# Altium schematic sheet In-Out.SchDoc
size A3
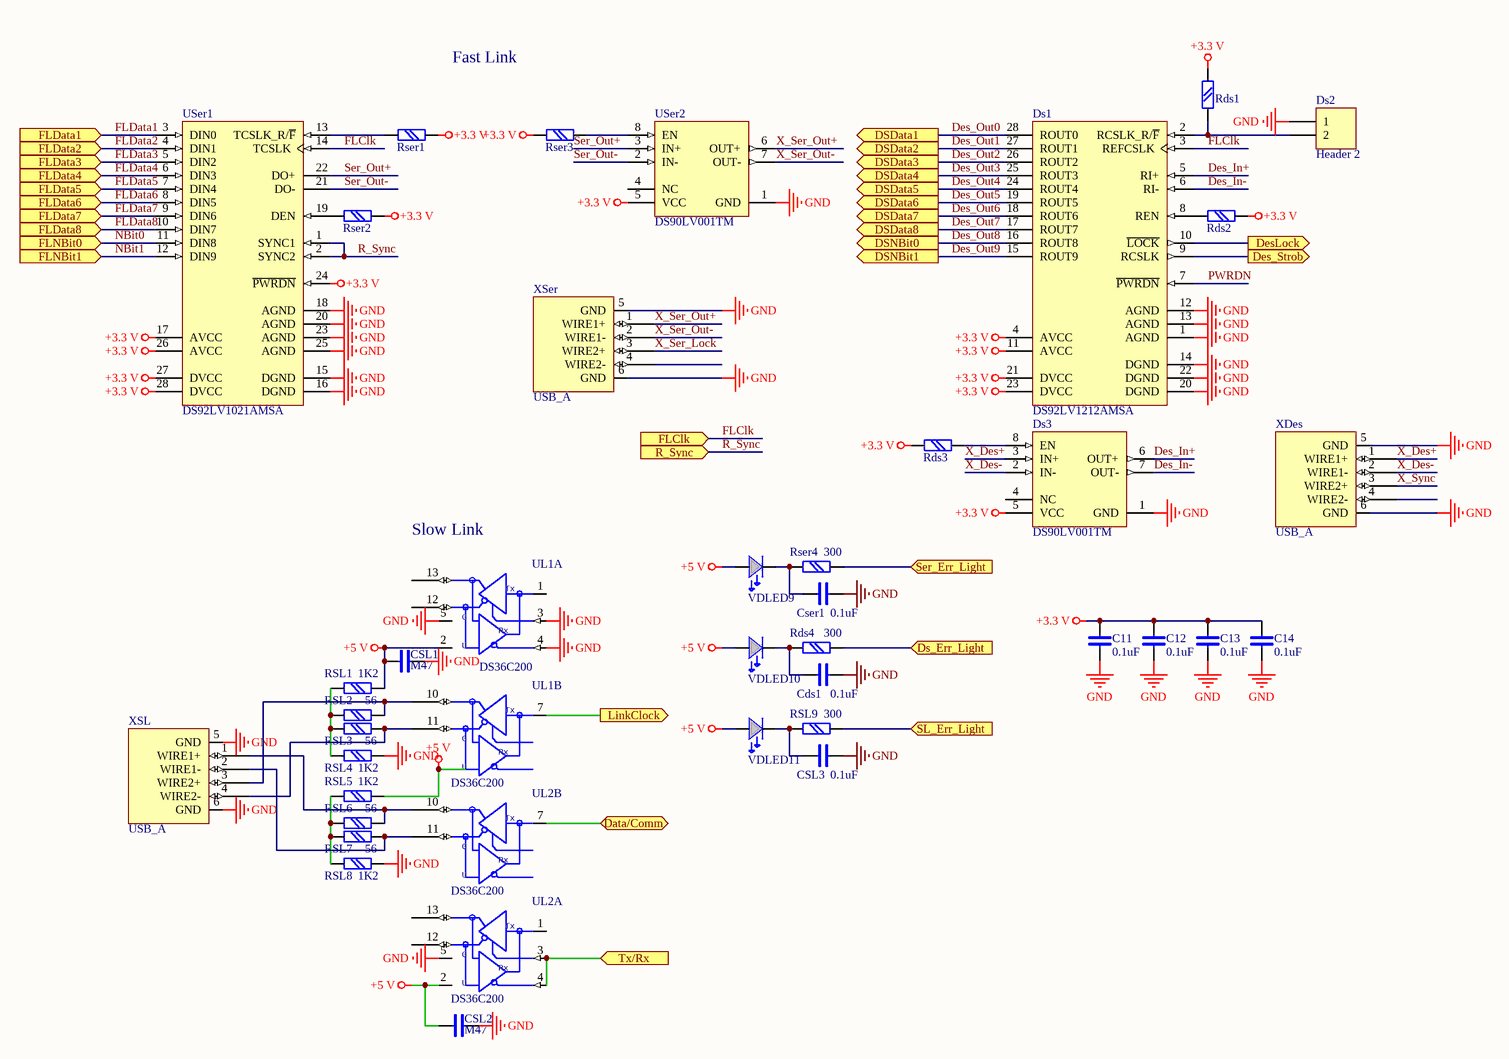
[diagram p0: In-Out.SchDoc]

## Parts
C11  0.1uF  [chip0805]
C12  0.1uF  [chip0805]
C13  0.1uF  [chip0805]
C14  0.1uF  [chip0805]
Cds1  0.1uF  [chip0805]
Cser1  0.1uF  [chip0805]
CSL1  M47  [chip0805]
CSL2  M47  [chip0805]
CSL3  0.1uF  [chip0805]
Ds1  DS92LV1212AMSA  [MSA28_N]
Ds2  Header 2  [HDR1X2]
Ds3  DS90LV001TM  [M08A_N]
Rds1  R  [chip0805]  (value not drawn)
Rds2  R  [chip0805]  (value not drawn)
Rds3  R  [chip0805]  (value not drawn)
Rds4  300  [chip0805]
Rser1  R  [chip0805]  (value not drawn)
Rser2  R  [chip0805]  (value not drawn)
Rser3  R  [chip0805]  (value not drawn)
Rser4  300  [chip0805]
RSL1  1K2  [chip0805]
RSL2  56  [chip0805]
RSL3  56  [chip0805]
RSL4  1K2  [chip0805]
RSL5  1K2  [chip0805]
RSL6  56  [chip0805]
RSL7  56  [chip0805]
RSL8  1K2  [chip0805]
RSL9  300  [chip0805]
UL1  DS36C200  [M14A_N]  (parts A,B of 2)
UL2  DS36C200  [M14A_N]  (parts A,B of 2)
USer1  DS92LV1021AMSA  [MSA28_N]
USer2  DS90LV001TM  [M08A_N]
VDLED9  LED  [LED2P5_H]  (value not drawn)
VDLED10  LED  [LED2P5_H]  (value not drawn)
VDLED11  LED  [LED2P5_H]  (value not drawn)
XDes  USB_A  [USB2.5-2H4B]
XSer  USB_A  [USB2.5-2H4B]
XSL  USB_A  [USB2.5-2H4B]

## Ports
Data/Comm (bidir), Des_Strob (out), DesLock (out), Ds_Err_Light (in), DSData1 (out), DSData2 (out), DSData3 (out), DSData4 (out), DSData5 (out), DSData6 (out), DSData7 (out), DSData8 (out), DSNBit0 (out), DSNBit1 (out), FLClk (in), FLData1 (in), FLData2 (in), FLData3 (in), FLData4 (in), FLData5 (in), FLData6 (in), FLData7 (in), FLData8 (in), FLNBit0 (in), FLNBit1 (in), LinkClock (out), R_Sync (in), Ser_Err_Light (in), SL_Err_Light (in), Tx/Rx (in)

## Nets
+3.3 V: C11.2 C12.2 C13.2 C14.2 Ds1.4(AVCC) Ds1.11(AVCC) Ds1.21(DVCC) Ds1.23(DVCC) Ds3.5(VCC) Rds1.1 Rds2.2 Rds3.2 Rser1.1 Rser2.2 Rser3.2 USer1.17(AVCC) USer1.24(~{PWRDN}) USer1.26(AVCC) USer1.27(DVCC) USer1.28(DVCC) USer2.5(VCC)
+5 V: CSL1.1 CSL2.1 RSL1.2 RSL5.2 UL1.2(VCC) UL2.2(VCC) VDLED9.ANOD VDLED10.ANOD VDLED11.ANOD
GND: C11.1 C12.1 C13.1 C14.1 Cds1.2 Cser1.2 CSL1.2 CSL2.2 CSL3.2 Ds1.1(AGND) Ds1.12(AGND) Ds1.13(AGND) Ds1.14(DGND) Ds1.20(DGND) Ds1.22(DGND) Ds2.1 Ds3.1(GND) RSL4.2 RSL8.2 UL1.3(TE) UL1.4(RE) UL1.5(GND) UL2.5(GND) USer1.15(DGND) USer1.16(DGND) USer1.18(AGND) USer1.20(AGND) USer1.23(AGND) USer1.25(AGND) USer2.1(GND) XDes.5(GND) XDes.6(GND) XSer.5(GND) XSer.6(GND) XSL.5(GND) XSL.6(GND)
Data/Comm: UL2.7(DATA) ; port Data/Comm
Des_In+: Ds1.5(RI+) Ds3.6(OUT+)
Des_In-: Ds1.6(RI-) Ds3.7(OUT-)
Des_Out0: Ds1.28(ROUT0) ; port DSData1
Des_Out1: Ds1.27(ROUT1) ; port DSData2
Des_Out2: Ds1.26(ROUT2) ; port DSData3
Des_Out3: Ds1.25(ROUT3) ; port DSData4
Des_Out4: Ds1.24(ROUT4) ; port DSData5
Des_Out5: Ds1.19(ROUT5) ; port DSData6
Des_Out6: Ds1.18(ROUT6) ; port DSData7
Des_Out7: Ds1.17(ROUT7) ; port DSData8
Des_Out8: Ds1.16(ROUT8) ; port DSNBit0
Des_Out9: Ds1.15(ROUT9) ; port DSNBit1
Des_Strob: Ds1.9(RCSLK) ; port Des_Strob
DesLock: Ds1.10(~{LOCK}) ; port DesLock
Ds_Err_Light: Rds4.1 ; port Ds_Err_Light
FLClk: Ds1.3(REFCSLK) USer1.14(TCSLK) ; port FLClk
FLData1: USer1.3(DIN0) ; port FLData1
FLData2: USer1.4(DIN1) ; port FLData2
FLData3: USer1.5(DIN2) ; port FLData3
FLData4: USer1.6(DIN3) ; port FLData4
FLData5: USer1.7(DIN4) ; port FLData5
FLData6: USer1.8(DIN5) ; port FLData6
FLData7: USer1.9(DIN6) ; port FLData7
FLData8: USer1.10(DIN7) ; port FLData8
LinkClock: UL1.7(DATA) ; port LinkClock
NBit0: USer1.11(DIN8) ; port FLNBit0
NBit1: USer1.12(DIN9) ; port FLNBit1
PWRDN: Ds1.7(~{PWRDN})
R_Sync: USer1.1(SYNC1) USer1.2(SYNC2) ; port R_Sync
Ser_Err_Light: Rser4.1 ; port Ser_Err_Light
Ser_Out+: USer1.22(DO+) USer2.3(IN+)
Ser_Out-: USer1.21(DO-) USer2.2(IN-)
SL_Err_Light: RSL9.1 ; port SL_Err_Light
Tx/Rx: UL2.3(TE) UL2.4(RE) ; port Tx/Rx
X_Des+: Ds3.3(IN+) XDes.1(WIRE1+)
X_Des-: Ds3.2(IN-) XDes.2(WIRE1-)
X_Ser_Lock: XSer.3(WIRE2+)
X_Ser_Out+: USer2.6(OUT+) XSer.1(WIRE1+)
X_Ser_Out-: USer2.7(OUT-) XSer.2(WIRE1-)
X_Sync: XDes.3(WIRE2+)
NetCds1_1: Cds1.1 Rds4.2 VDLED10.CATH
NetCser1_1: Cser1.1 Rser4.2 VDLED9.CATH
NetCSL3_1: CSL3.1 RSL9.2 VDLED11.CATH
NetDs1_2: Ds1.2(RCSLK_R/~{F}) Ds2.2 Rds1.2
NetDs1_8: Ds1.8(REN) Rds2.1
NetDs3_8: Ds3.8(EN) Rds3.1
NetRser1_2: Rser1.2 USer1.13(TCSLK_R/~{F})
NetRser2_1: Rser2.1 USer1.19(DEN)
NetRser3_1: Rser3.1 USer2.8(EN)
NetRSL1_1: RSL1.1 RSL2.1 RSL3.1 RSL4.1
NetRSL2_2: RSL2.2 UL1.10(WIRE+) XSL.3(WIRE2+)
NetRSL3_2: RSL3.2 UL1.11(WIRE-) XSL.4(WIRE2-)
NetRSL5_1: RSL5.1 RSL6.1 RSL7.1 RSL8.1
NetRSL6_2: RSL6.2 UL2.10(WIRE+) XSL.1(WIRE1+)
NetRSL7_2: RSL7.2 UL2.11(WIRE-) XSL.2(WIRE1-)

Not connected (* = marked no-connect by the designer): Ds3 4(NC); UL1 1(DATA) 12(WIRE-) 13(WIRE+); UL2 1(DATA) 12(WIRE-) 13(WIRE+); USer2 4(NC); XDes 4(WIRE2-); XSer 4(WIRE2-)

## Notes on the sheet
- Fast Link
- (near UL1) Slow Link
- (in symbol DS36C200, part A) Tx; G; Rx; U
- (in symbol DS36C200, part B) Tx; G; Rx; U

## Library data of the parts
C11-C14 Cds1 Cser1 CSL1-CSL3 = C: Text Field1: 20; Text Field2: 10
Ds1 = DS92LV1212AMSA: 16 MHz - 40 MHz 10-Bit Bus LVDS Random Lock Deserializer with Embedded Clock Recovery, 28-pin SSOP-EIAJ; Manufacturer: National Semiconductor; PackageTopMarking: NSUZXYTTE#*DS92LV1212A*MSA; PowerWise: N; CompType: Interface IC; Published: 4-Dec-2008; DatasheetVersion: Nov-2000; PackageVersion: revC, Oct-2009; PackageReference: MSA28; Publisher: Altium Limited; PackageDescription: Molded SSOP, 5.3mm Body Width, 0.65mm Pitch, EIAJ, Type II, 28 Lead; Supplier 1: Farnell; Supplier Part Number 1: 7610683; PartNumber: DS92LV1212AMSA; RoHS: N; PinCount: 28; Code_IPC: SOP65P780-28; ComponentLink1Description: DS92LV1212A Datasheet; ComponentLink1URL: http://www.national.com/ds/DS/DS92LV1212A.pdf; ComponentLink2Description: DS92LV1212A Web Page; ComponentLink2URL: http://www.national.com/pf/DS/DS92LV1212A.html; ComponentLink3Description: MSA28 Package Page; ComponentLink3URL: http://www.national.com/packaging/folders/msa28.html
Ds2 = Header 2: Header, 2-Pin; LatestRevisionDate: 17-Jul-2002; LatestRevisionNote: Re-released for DXP Platform.; Publisher: Altium Limited
Ds3 USer2 = DS90LV001TM: 800 Mbps LVDS Buffer, 8-pin Narrow SOIC; Manufacturer: National Semiconductor; PackageTopMarking: NSZXTT*LV001*TM; PowerWise: N; CompType: Interface IC; Published: 4-Dec-2008; DatasheetVersion: Feb-2008; PackageVersion: revM, May-2009; PackageReference: M08A; Publisher: Altium Limited; PackageDescription: SOIC Narrow, 4.9 x 3.9 x 1.45mm, 8 Lead, 1.27mm Pitch; PartNumber: DS90LV001TM; RoHS: N; PinCount: 8; Code_JEDEC: MS-012-AA; Code_IPC: SOIC127P600-8; ComponentLink1Description: DS90LV001 Datasheet; ComponentLink1URL: http://www.national.com/ds/DS/DS90LV001.pdf; ComponentLink2Description: DS90LV001 Web Page; ComponentLink2URL: http://www.national.com/pf/DS/DS90LV001.html; ComponentLink3Description: M08A Package Page; ComponentLink3URL: http://www.national.com/packaging/folders/m08a.html
Rds1-Rds4 Rser1-Rser4 RSL1-RSL9 = R: Text Field1: 20; Text Field2: 20
UL1 UL2 = DS36C200: Text Field1: 60; Text Field2: 70
USer1 = DS92LV1021AMSA: 16 MHz - 40 MHz 10-Bit Serializer, 28-pin SSOP-EIAJ; Manufacturer: National Semiconductor; PackageTopMarking: NSUZXYTTE#*DS92LV1021A*MSA BBBBB; PowerWise: N; CompType: Interface IC; Published: 4-Dec-2008; DatasheetVersion: Jan-2003; PackageVersion: revC, Oct-2009; PackageReference: MSA28; Publisher: Altium Limited; PackageDescription: Molded SSOP, 5.3mm Body Width, 0.65mm Pitch, EIAJ, Type II, 28 Lead; Supplier 1: Farnell; Supplier Part Number 1: 8206830; PartNumber: DS92LV1021AMSA; RoHS: N; PinCount: 28; Code_IPC: SOP65P780-28; ComponentLink1Description: DS92LV1021A Datasheet; ComponentLink1URL: http://www.national.com/ds/DS/DS92LV1021A.pdf; ComponentLink2Description: DS92LV1021A Web Page; ComponentLink2URL: http://www.national.com/pf/DS/DS92LV1021A.html; ComponentLink3Description: MSA28 Package Page; ComponentLink3URL: http://www.national.com/packaging/folders/msa28.html
VDLED9-VDLED11 = AL307: Text Field1: 10; Text Field2: 30
XDes XSer XSL = USB_A: Text Field1: 60; Text Field2: 70